# Altium schematic sheet 06 DDR PART1.SchDoc
size 420 x 297 mm
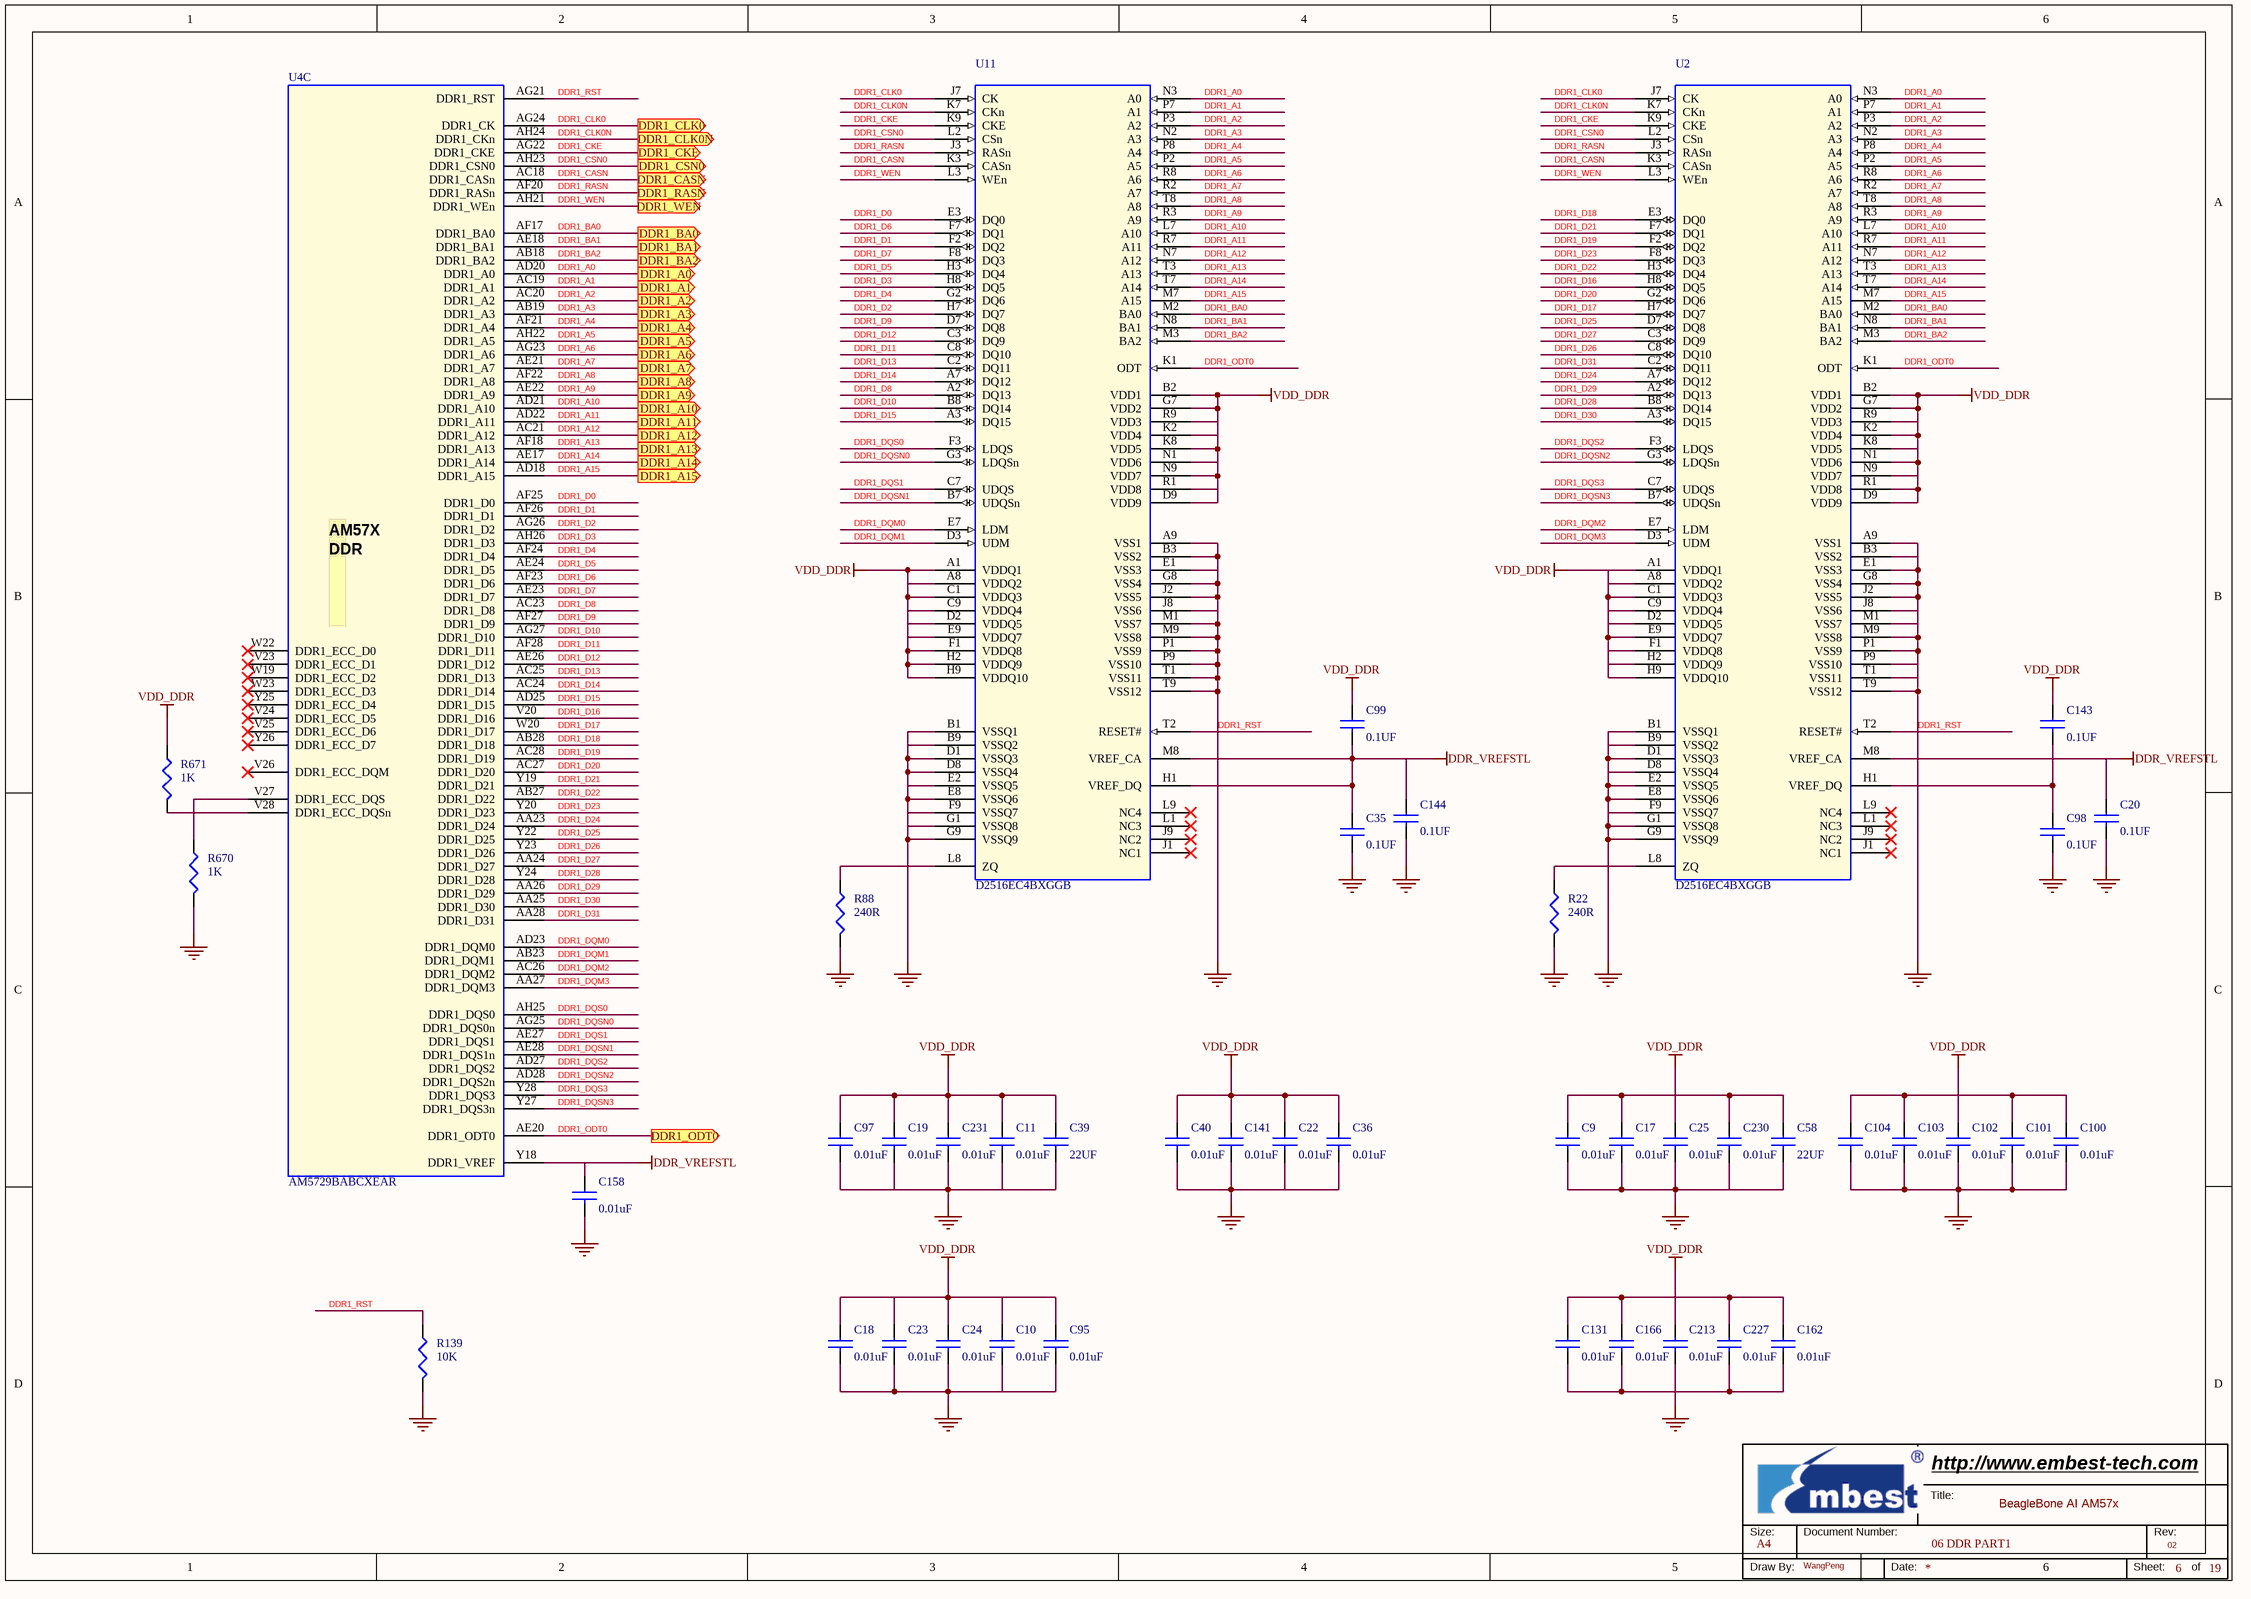
[diagram p0: 06 DDR PART1.SchDoc]

## Parts
*  Page Count: 19  Page Number: 6  Page Size: A4  Title: BeagleBone AI AM57x  RevCode: 02  Doc: 06 DDR PART1  Drawing: WangPeng  (hidden comment: Embest Title)  (graphical)
C9  0.01uF  [C0402]
C10  0.01uF  [C0402]
C11  0.01uF  [C0402]
C17  0.01uF  [C0402]
C18  0.01uF  [C0402]
C19  0.01uF  [C0402]
C20  0.1UF  [C0402]
C22  0.01uF  [C0402]
C23  0.01uF  [C0402]
C24  0.01uF  [C0402]
C25  0.01uF  [C0402]
C35  0.1UF  [C0402]
C36  0.01uF  [C0402]
C39  22UF  [C0603]
C40  0.01uF  [C0402]
C58  22UF  [C0603]
C95  0.01uF  [C0402]
C97  0.01uF  [C0402]
C98  0.1UF  [C0402]
C99  0.1UF  [C0402]
C100  0.01uF  [C0402]
C101  0.01uF  [C0402]
C102  0.01uF  [C0402]
C103  0.01uF  [C0402]
C104  0.01uF  [C0402]
C131  0.01uF  [C0402]
C141  0.01uF  [C0402]
C143  0.1UF  [C0402]
C144  0.1UF  [C0402]
C158  0.01uF  [C0402]
C162  0.01uF  [C0402]
C166  0.01uF  [C0402]
C213  0.01uF  [C0402]
C227  0.01uF  [C0402]
C230  0.01uF  [C0402]
C231  0.01uF  [C0402]
R22  240R  [R0402]
R88  240R  [R0402]
R139  10K  [R0402]
R670  1K  [R0402]
R671  1K  [R0402]
U2  D2516EC4BXGGB  [ddr2_fbga60pin]
U4  AM5729BABCXEAR  [BGA23X23-760-117M]  (part C of 29)
U11  D2516EC4BXGGB  [ddr2_fbga60pin]

## Ports
DDR1_A0 (out), DDR1_A1 (out), DDR1_A2 (out), DDR1_A3 (out), DDR1_A4 (out), DDR1_A5 (out), DDR1_A6 (out), DDR1_A7 (out), DDR1_A8 (out), DDR1_A9 (out), DDR1_A10 (out), DDR1_A11 (out), DDR1_A12 (out), DDR1_A13 (out), DDR1_A14 (out), DDR1_A15 (out), DDR1_BA0 (out), DDR1_BA1 (out), DDR1_BA2 (out), DDR1_CASN (out), DDR1_CKE (out), DDR1_CLK0 (out), DDR1_CLK0N (out), DDR1_CSN0 (out), DDR1_ODT0 (out), DDR1_RASN (out), DDR1_WEN (out)

## Nets
DDR1_RST: C9.2 C10.2 C11.2 C17.2 C18.2 C19.2 C20.2 C22.2 C23.2 C24.2 C25.2 C35.2 C36.2 C39.2 C40.2 C58.2 C95.2 C97.2 C98.2 C100.2 C101.2 C102.2 C103.2 C104.2 C141.2 C144.2 C158.2 C213.2 C230.2 C231.2 R22.2 R88.2 R139.1 R139.2 R670.2 U2.A9(VSS1) U2.B1(VSSQ1) U2.B3(VSS2) U2.B9(VSSQ2) U2.D1(VSSQ3) U2.D8(VSSQ4) U2.E1(VSS3) U2.E2(VSSQ5) U2.E8(VSSQ6) U2.F9(VSSQ7) U2.G1(VSSQ8) U2.G8(VSS4) U2.G9(VSSQ9) U2.J2(VSS5) U2.J8(VSS6) U2.M1(VSS7) U2.M9(VSS8) U2.P1(VSS9) U2.P9(VSS10) U2.T1(VSS11) U2.T2(RESET#) U2.T9(VSS12) U4.AG21(DDR1_RST) U11.A9(VSS1) U11.B1(VSSQ1) U11.B3(VSS2) U11.B9(VSSQ2) U11.D1(VSSQ3) U11.D8(VSSQ4) U11.E1(VSS3) U11.E2(VSSQ5) U11.E8(VSSQ6) U11.F9(VSSQ7) U11.G1(VSSQ8) U11.G8(VSS4) U11.G9(VSSQ9) U11.J2(VSS5) U11.J8(VSS6) U11.M1(VSS7) U11.M9(VSS8) U11.P1(VSS9) U11.P9(VSS10) U11.T1(VSS11) U11.T2(RESET#) U11.T9(VSS12)  [also labelled GND]
DDR_VREFSTL: C20.1 C35.1 C99.2 C144.1 C158.1 U2.M8(VREF_CA) U4.Y18(DDR1_VREF) U11.H1(VREF_DQ) U11.M8(VREF_CA)
VDD_DDR: C10.1 C11.1 C18.1 C19.1 C22.1 C23.1 C24.1 C25.1 C36.1 C39.1 C40.1 C95.1 C97.1 C99.1 C102.1 C141.1 C143.1 C213.1 C231.1 R671.1 U2.A1(VDDQ1) U2.A8(VDDQ2) U2.B2(VDD1) U2.C1(VDDQ3) U2.C9(VDDQ4) U2.D2(VDDQ5) U2.D9(VDD9) U2.E9(VDDQ7) U2.F1(VDDQ8) U2.G7(VDD2) U2.H2(VDDQ9) U2.H9(VDDQ10) U2.K2(VDD4) U2.K8(VDD5) U2.N1(VDD6) U2.N9(VDD7) U2.R1(VDD8) U2.R9(VDD3) U11.A1(VDDQ1) U11.A8(VDDQ2) U11.B2(VDD1) U11.C1(VDDQ3) U11.C9(VDDQ4) U11.D2(VDDQ5) U11.D9(VDD9) U11.E9(VDDQ7) U11.F1(VDDQ8) U11.G7(VDD2) U11.H2(VDDQ9) U11.H9(VDDQ10) U11.K2(VDD4) U11.K8(VDD5) U11.N1(VDD6) U11.N9(VDD7) U11.R1(VDD8) U11.R9(VDD3)
DDR1_A0: U2.N3(A0) U4.AD20(DDR1_A0) U11.N3(A0) ; port DDR1_A0
DDR1_A1: U2.P7(A1) U4.AC19(DDR1_A1) U11.P7(A1) ; port DDR1_A1
DDR1_A2: U2.P3(A2) U4.AC20(DDR1_A2) U11.P3(A2) ; port DDR1_A2
DDR1_A3: U2.N2(A3) U4.AB19(DDR1_A3) U11.N2(A3) ; port DDR1_A3
DDR1_A4: U2.P8(A4) U4.AF21(DDR1_A4) U11.P8(A4) ; port DDR1_A4
DDR1_A5: U2.P2(A5) U4.AH22(DDR1_A5) U11.P2(A5) ; port DDR1_A5
DDR1_A6: U2.R8(A6) U4.AG23(DDR1_A6) U11.R8(A6) ; port DDR1_A6
DDR1_A7: U2.R2(A7) U4.AE21(DDR1_A7) U11.R2(A7) ; port DDR1_A7
DDR1_A8: U2.T8(A8) U4.AF22(DDR1_A8) U11.T8(A8) ; port DDR1_A8
DDR1_A9: U2.R3(A9) U4.AE22(DDR1_A9) U11.R3(A9) ; port DDR1_A9
DDR1_A10: U2.L7(A10) U4.AD21(DDR1_A10) U11.L7(A10) ; port DDR1_A10
DDR1_A11: U2.R7(A11) U4.AD22(DDR1_A11) U11.R7(A11) ; port DDR1_A11
DDR1_A12: U2.N7(A12) U4.AC21(DDR1_A12) U11.N7(A12) ; port DDR1_A12
DDR1_A13: U2.T3(A13) U4.AF18(DDR1_A13) U11.T3(A13) ; port DDR1_A13
DDR1_A14: U2.T7(A14) U4.AE17(DDR1_A14) U11.T7(A14) ; port DDR1_A14
DDR1_A15: U2.M7(A15) U4.AD18(DDR1_A15) U11.M7(A15) ; port DDR1_A15
DDR1_BA0: U2.M2(BA0) U4.AF17(DDR1_BA0) U11.M2(BA0) ; port DDR1_BA0
DDR1_BA1: U2.N8(BA1) U4.AE18(DDR1_BA1) U11.N8(BA1) ; port DDR1_BA1
DDR1_BA2: U2.M3(BA2) U4.AB18(DDR1_BA2) U11.M3(BA2) ; port DDR1_BA2
DDR1_CASN: U2.K3(CASn) U4.AC18(DDR1_CASn) U11.K3(CASn) ; port DDR1_CASN
DDR1_CKE: U2.K9(CKE) U4.AG22(DDR1_CKE) U11.K9(CKE) ; port DDR1_CKE
DDR1_CLK0: U2.J7(CK) U4.AG24(DDR1_CK) U11.J7(CK) ; port DDR1_CLK0
DDR1_CLK0N: U2.K7(CKn) U4.AH24(DDR1_CKn) U11.K7(CKn) ; port DDR1_CLK0N
DDR1_CSN0: U2.L2(CSn) U4.AH23(DDR1_CSN0) U11.L2(CSn) ; port DDR1_CSN0
DDR1_D0: U4.AF25(DDR1_D0) U11.E3(DQ0)
DDR1_D1: U4.AF26(DDR1_D1) U11.F2(DQ2)
DDR1_D2: U4.AG26(DDR1_D2) U11.H7(DQ7)
DDR1_D3: U4.AH26(DDR1_D3) U11.H8(DQ5)
DDR1_D4: U4.AF24(DDR1_D4) U11.G2(DQ6)
DDR1_D5: U4.AE24(DDR1_D5) U11.H3(DQ4)
DDR1_D6: U4.AF23(DDR1_D6) U11.F7(DQ1)
DDR1_D7: U4.AE23(DDR1_D7) U11.F8(DQ3)
DDR1_D8: U4.AC23(DDR1_D8) U11.A2(DQ13)
DDR1_D9: U4.AF27(DDR1_D9) U11.D7(DQ8)
DDR1_D10: U4.AG27(DDR1_D10) U11.B8(DQ14)
DDR1_D11: U4.AF28(DDR1_D11) U11.C8(DQ10)
DDR1_D12: U4.AE26(DDR1_D12) U11.C3(DQ9)
DDR1_D13: U4.AC25(DDR1_D13) U11.C2(DQ11)
DDR1_D14: U4.AC24(DDR1_D14) U11.A7(DQ12)
DDR1_D15: U4.AD25(DDR1_D15) U11.A3(DQ15)
DDR1_D16: U2.H8(DQ5) U4.V20(DDR1_D16)
DDR1_D17: U2.H7(DQ7) U4.W20(DDR1_D17)
DDR1_D18: U2.E3(DQ0) U4.AB28(DDR1_D18)
DDR1_D19: U2.F2(DQ2) U4.AC28(DDR1_D19)
DDR1_D20: U2.G2(DQ6) U4.AC27(DDR1_D20)
DDR1_D21: U2.F7(DQ1) U4.Y19(DDR1_D21)
DDR1_D22: U2.H3(DQ4) U4.AB27(DDR1_D22)
DDR1_D23: U2.F8(DQ3) U4.Y20(DDR1_D23)
DDR1_D24: U2.A7(DQ12) U4.AA23(DDR1_D24)
DDR1_D25: U2.D7(DQ8) U4.Y22(DDR1_D25)
DDR1_D26: U2.C8(DQ10) U4.Y23(DDR1_D26)
DDR1_D27: U2.C3(DQ9) U4.AA24(DDR1_D27)
DDR1_D28: U2.B8(DQ14) U4.Y24(DDR1_D28)
DDR1_D29: U2.A2(DQ13) U4.AA26(DDR1_D29)
DDR1_D30: U2.A3(DQ15) U4.AA25(DDR1_D30)
DDR1_D31: U2.C2(DQ11) U4.AA28(DDR1_D31)
DDR1_DQM0: U4.AD23(DDR1_DQM0) U11.E7(LDM)
DDR1_DQM1: U4.AB23(DDR1_DQM1) U11.D3(UDM)
DDR1_DQM2: U2.E7(LDM) U4.AC26(DDR1_DQM2)
DDR1_DQM3: U2.D3(UDM) U4.AA27(DDR1_DQM3)
DDR1_DQS0: U4.AH25(DDR1_DQS0) U11.F3(LDQS)
DDR1_DQS1: U4.AE27(DDR1_DQS1) U11.C7(UDQS)
DDR1_DQS2: U2.F3(LDQS) U4.AD27(DDR1_DQS2)
DDR1_DQS3: U2.C7(UDQS) U4.Y28(DDR1_DQS3)
DDR1_DQSN0: U4.AG25(DDR1_DQS0n) U11.G3(LDQSn)
DDR1_DQSN1: U4.AE28(DDR1_DQS1n) U11.B7(UDQSn)
DDR1_DQSN2: U2.G3(LDQSn) U4.AD28(DDR1_DQS2n)
DDR1_DQSN3: U2.B7(UDQSn) U4.Y27(DDR1_DQS3n)
DDR1_ODT0: U2.K1(ODT) U4.AE20(DDR1_ODT0) U11.K1(ODT) ; port DDR1_ODT0
DDR1_RASN: U2.J3(RASn) U4.AF20(DDR1_RASn) U11.J3(RASn) ; port DDR1_RASN
DDR1_WEN: U2.L3(WEn) U4.AH21(DDR1_WEn) U11.L3(WEn) ; port DDR1_WEN
NetC9_1: C9.1 C17.1 C58.1 C230.1
NetC98_1: C98.1 C143.2 U2.H1(VREF_DQ)
NetC100_1: C100.1 C101.1 C103.1 C104.1
NetC131_1: C131.1 C162.1 C166.1 C227.1
NetC131_2: C131.2 C162.2 C166.2 C227.2
NetR22_1: R22.1 U2.L8(ZQ)
NetR88_1: R88.1 U11.L8(ZQ)
NetR670_1: R670.1 U4.V27(DDR1_ECC_DQS)
NetR671_2: R671.2 U4.V28(DDR1_ECC_DQSn)

Not connected (* = marked no-connect by the designer): U2 J1(NC1)* J9(NC2)* L1(NC3)* L9(NC4)*; U4 V23(DDR1_ECC_D1)* V24(DDR1_ECC_D5)* V25(DDR1_ECC_D6)* V26(DDR1_ECC_DQM)* W19(DDR1_ECC_D2)* W22(DDR1_ECC_D0)* W23(DDR1_ECC_D3)* Y25(DDR1_ECC_D4)* Y26(DDR1_ECC_D7)*; U11 J1(NC1)* J9(NC2)* L1(NC3)* L9(NC4)*

## Notes on the sheet
- (in symbol AM57X, part C) AM57X DDR /
- (in symbol Embest Title) Title:; Size:; Document Number:; Rev:; Draw By:; Date:; Sheet:; of

## Library data of the parts
C9 C17 C18 C23 C103 C104 C131 C166 = C: CAP,10NF,+/-10%,X7R,16V,SMD0402; Manufacturer: MURATA; Manufacturer Part Number: GRM155R71C103KA01D; Embest PN: 1004001100039; Part Type: Ceramic Capacitor
C10 C11 C22 C24 C25 C36 C95 C100-C102 C162 C213 C227 C230 C231 = C: CAP,10NF,+/-10%,X7R,16V,SMD0402; Manufacturer Part Number: GRM155R71C103KA01D; Manufacturer: MURATA; Embest PN: 1004001100039; Part Type: Ceramic Capacitor
C19 C40 C97 C158 = C: CAP,10NF,+/-10%,X7R,16V,SMD0402; Manufacturer: MURATA; Manufacturer Part Number: GRM155R71C103KA01D; SIGNAL_MODEL: CAP_0.1UF_X7R_16V_10%_0402__402_0.1uf_16V; Embest PN: 1004001100039; Part Type: Ceramic Capacitor
C20 C35 C98 C144 = C: CAP,100NF,+/-10%,X7R,16V,SMD0402; Manufacturer: Murata; Manufacturer Part Number: GRM155R71C104KA88D; Embest PN: 1004001100047; Part Type: Ceramic Capacitor; Datasheet: Y:\ÐÂK3ÏµÍ³ÎïÁÏdatasheet\[1003_1004]capacitor-resistor µçÈÝ¡¢µç×è\1004001100047-GRM155R71C104KA88D.pdf
C39 = C: CAP,22UF,+/-20%,X5R,6.3V,SMD0603; Manufacturer: MURATA; Manufacturer Part Number: GRM188R60J226MEA0D; Embest PN: 1004001100130; Part Type: Ceramic Capacitor
C58 = C: CAP,22UF,+/-20%,x5R,10V,SMD0603; Manufacturer: Murata; Manufacturer Part Number: GRM188R61A226ME15D; Embest PN: 1004001100311; Part Type: Ceramic Capacitor; Datasheet: Y:\ÐÂK3ÏµÍ³ÎïÁÏdatasheet\[1003_1004]capacitor-resistor µçÈÝ¡¢µç×è\1004001100311 GRM188R61A226ME15D murata.pdf
C99 = C: CAP,100NF,+/-10%,X7R,16V,SMD0402; Manufacturer Part Number: GRM155R71C104KA88D; Manufacturer: Murata; SIGNAL_MODEL: CAP_0.1UF_X7R_16V_10%_0402__402_0.1uf_16V; Embest PN: 1004001100047; Datasheet: Y:\ÐÂK3ÏµÍ³ÎïÁÏdatasheet\[1003_1004]capacitor-resistor µçÈÝ¡¢µç×è\1004001100047-GRM155R71C104KA88D.pdf; Part Type: Ceramic Capacitor
C141 = C: CAP,10NF,+/-10%,X7R,16V,SMD0402; Manufacturer Part Number: GRM155R71C103KA01D; Manufacturer: MURATA; SIGNAL_MODEL: CAP_0.1UF_X7R_16V_10%_0402__402_0.1uf_16V; Embest PN: 1004001100039; Part Type: Ceramic Capacitor
C143 = C: CAP,100NF,+/-10%,X7R,16V,SMD0402; Manufacturer Part Number: GRM155R71C104KA88D; Manufacturer: Murata; Embest PN: 1004001100047; Datasheet: Y:\ÐÂK3ÏµÍ³ÎïÁÏdatasheet\[1003_1004]capacitor-resistor µçÈÝ¡¢µç×è\1004001100047-GRM155R71C104KA88D.pdf; Part Type: Ceramic Capacitor
R22 = R: RES,240R,+/-1%,1/16W,SMD0402; Manufacturer Part Number: RC0402FR-07240RL; Manufacturer: YAGEO; SIGNAL_MODEL: RES_0_1/16W_1%_0402_402_0_1%_0_1%; Embest PN: 1003001100026; Part Type: Thick film Resistor
R88 = R: RES,240R,+/-1%,1/16W,SMD0402; Manufacturer: YAGEO; Manufacturer Part Number: RC0402FR-07240RL; Embest PN: 1003001100026; Part Type: Thick film Resistor
R139 = R: RES,10K,+/-5%,1/16W,SMD0402; Manufacturer Part Number: RC0402JR-0710KL; Manufacturer: YAGEO; Embest PN: 1003001100072; Part Type: Thick film Resistor
R670 = R: RES,1K,+/-5%,1/16W,SMD0402; Manufacturer Part Number: RC0402JR-071KL; Manufacturer: YAGEO; Embest PN: 1003001100035; Part Type: Thick film Resistor
R671 = R: RES,1K,+/-5%,1/16W,SMD0402; Manufacturer: YAGEO; Manufacturer Part Number: RC0402JR-071KL; Embest PN: 1003001100035; Part Type: Thick film Resistor
U2 U11 = D2516EC4BXGGB_0: IC,DDR3L 4 GB (256M x 16) DDR3/3L-1600 Mbps DRAM - FBGA-96 Tray; Manufacturer: KINGSTON; Embest PN: 1002003100222; Datasheet: Y:\ÐÂK3ÏµÍ³ÎïÁÏdatasheet\[1002]IC ¼¯³ÉµçÂ·\1002003100222 D2516EC4BXGGB.pdf; Status: TBD; Manufacturer Part Number: D2516EC4BXGGB; Part Type: Memory
U4 = AM57X: IC ARM Dual Cortex-A15 Microprocessor FCBGA(ABC)-760 SMD JEDEC TRAY; Vendor: TI; Embest PN: 1002001100053; Part Type: MPU; Manufacturer: TI; Manufacturer Part Number: AM5729BABCXEAR; Status: BeagleBone AI
* = Embest Title: Page Create Date: May 29, 2006; WebSite: http://www.embest-tech.com; Company: Embest; Page Modify Date: *